# Altium schematic sheet E32_Lora_T20S868MHz.SchDoc
size A4; Organization: Altium Limited; Address1: L3, 12a Rodborough Rd; Address2: Frenchs Forest; Address3: NSW; Address4: Australia 2086
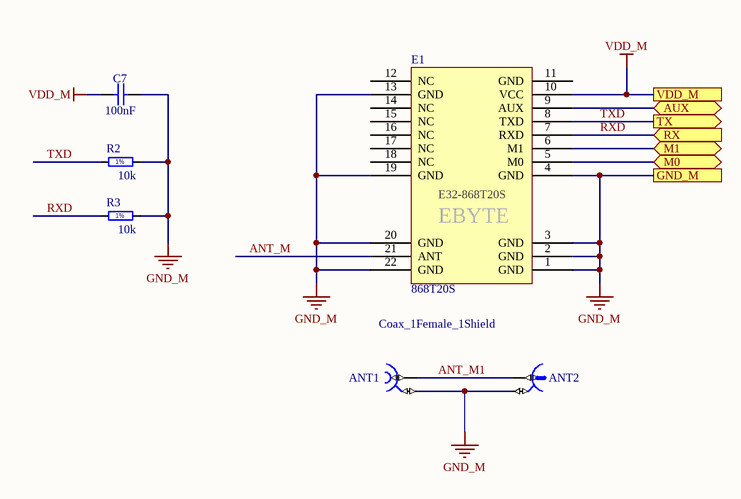
[diagram p0: E32_Lora_T20S868MHz.SchDoc]

## Parts
ANT1  Coax_1Female_1Shield  [HUBER-SUHNER_85 SMA-50-0-101/111 NE]
ANT2  U.FL  [HIROSE_U.FL-R-SMT-1(10)]  (value not drawn)
C7  100nF  [CAPC1608X87N]
E1  868T20S  [E32-T20S]
R2  10k  [RESC1608X55N]
R3  10k  [RESC1608X55N]

## Ports
AUX (bidir), GND_M, M0 (bidir), M1 (bidir), RX (in), TX (out), VDD_M

## Nets
GND_M: ANT1.2 ANT2.2 C7.2 E1.1(GND) E1.2(GND) E1.3(GND) E1.4(GND) E1.13(GND) E1.19(GND) E1.20(GND) E1.22(GND) R2.2 R3.2 ; port GND_M
VDD_M: C7.1 E1.10(VCC) ; port VDD_M
ANT_M: E1.21(ANT)
ANT_M1: ANT1.1 ANT2.1
AUX: E1.9(AUX) ; port AUX
M0: E1.5(M0) ; port M0
M1: E1.6(M1) ; port M1
RXD: E1.7(RXD) R3.1 ; port RX
TXD: E1.8(TXD) R2.1 ; port TX

Not connected (* = marked no-connect by the designer): E1 11(GND) 12(NC) 14(NC) 15(NC) 16(NC) 17(NC) 18(NC)

## Notes on the sheet
- Title
- Size:
- Date:
- A4
- Number:
- Time:
- Revision:
- Sheet
- of
- File:
- (in symbol E32-868T20S) EBYTE
- (in symbol R0603_10K_1%_0.1W_100PPM) 1%

## Library data of the parts
ANT1 = HUBER-SUHNER_85_SMA-50-0-101/111_NE: Part Description: SMA 50 Ohms Right Angle PCB Jack; Manufacturer: HUBER+SUHNER; Table: Miscellaneous; Part Number: HUBER-SUHNER_85_SMA-50-0-101/111_NE; Component Kind: Standard; Component Type: Standard; Pin Count: 2; Family: SMA; Mounted: Yes; Socket: No; SMD: No; Status: None; Manufacturer Part Number: 85_SMA-50-0-101/111_NE; ComponentHeight: 9.6mm; HelpURL: \\cern.ch\dfs\Applications\Altium\Datasheets\HUBER-SUHNER_85 SMA-50-0-101-111 NE.pdf; Author: CERN DEM JLC; CreateDate: 20-Apr-10; LatestRevisionDate: 27-Apr-10
ANT2 = HIROSE_U.FL-R-SMT-1(10): Part Description: Up to 6GHz Ultra Small Surface Mount Male Coaxial Connectors U.FL Series; Manufacturer: HIROSE (HRS); Table: Miscellaneous; Part Number: HIROSE_U.FL-R-SMT-1(10); Component Kind: Standard; Component Type: Standard; Pin Count: 2; Family: U.FL; Mounted: Yes; Socket: No; SMD: Yes; Status: None; Manufacturer Part Number: U.FL-R-SMT-1(10); ComponentHeight: 1.25mm; HelpURL: \\cern.ch\dfs\Applications\Altium\Datasheets\HIROSE_U.FL-R-SMT-1(10).pdf; Author: CERN DEM JLC; CreateDate: 24-Mar-10; LatestRevisionDate: 24-Mar-10
C7 = CC0603_100NF_50V_10%_X7R: Non-polarised capacitor; Part Description: SMD Multilayer Chip Ceramic Capacitor; Manufacturer: GENERIC; Manufacturer1 Part Number: 223858615649; Voltage: 50V; TC: X7R; Tolerance: ±10%; Table: Capacitors SMD; Part Number: CC0603_100NF_50V_10%_X7R; Component Kind: Standard; Component Type: Standard; Pin Count: 2; Value: 100nF; Status: Preferred; Manufacturer Part Number: CC0603_100NF_50V_10%_X7R; Case: 0603; Mounted: Yes; Socket: No; SMD: Yes; Manufacturer1 Example: PHYCOMP; Manufacturer1 ComponentHeight: 0.87mm; HelpURL: \\cern.ch\dfs\Applications\Altium\Datasheets\CC0603_X7R_PHYCOMP.pdf; Author: CERN DEM JLC; CreateDate: 03-Dec-07; LatestRevisionDate: 03-Dec-07
E1 = E32-868T20S: Lora Ebyte E32-T30S Module
R2 R3 = R0603_10K_1%_0.1W_100PPM: Resistor - 1%; Part Description: General Purpose Thick Film Chip Resistor; Manufacturer: GENERIC; Manufacturer1 Part Number: NRC06F1002TRF; Power: 0.1W; TC: ±100ppm/°C; Table: Resistors SMD; Part Number: R0603_10K_1%_0.1W_100PPM; Component Kind: Standard; Component Type: Standard; Pin Count: 2; Value: 10k; Status: Preferred; Tolerance: ±1%; Manufacturer Part Number: R0603_10K_1%_0.1W_100PPM; Case: 0603; Mounted: Yes; Socket: No; SMD: Yes; Manufacturer1 Example: NIC COMPONENT; Manufacturer1 ComponentHeight: 0.55mm; HelpURL: \\cern.ch\dfs\Applications\Altium\Datasheets\R0603_NIC_NRC.pdf; Author: CERN DEM JLC; CreateDate: 03-Dec-07; LatestRevisionDate: 13-Mar-08